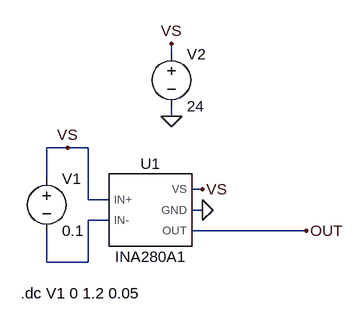
[diagram p0: schematic INA280A1_test.asc]
INA280A1_test.asc, the LTspice schematic file:
Version 4
SHEET 1 880 680
WIRE 0 -80 0 -96
WIRE 0 16 0 0
WIRE -160 64 -192 64
WIRE -128 64 -160 64
WIRE -192 112 -192 64
WIRE 48 128 32 128
WIRE -128 144 -128 64
WIRE -96 144 -128 144
WIRE 48 160 32 160
WIRE -96 176 -128 176
WIRE 208 192 32 192
WIRE -192 240 -192 192
WIRE -128 240 -128 176
WIRE -128 240 -192 240
FLAG 0 16 0
FLAG 0 -96 VS
FLAG 48 128 VS
FLAG 48 160 0
FLAG 208 192 OUT
FLAG -160 64 VS
SYMBOL INA280A1 -32 160 R0
SYMATTR InstName U1
SYMBOL voltage -192 96 R0
WINDOW 123 0 0 Left 0
WINDOW 39 0 0 Left 0
SYMATTR InstName V1
SYMATTR Value 0.1
SYMBOL voltage 0 -96 R0
WINDOW 123 0 0 Left 0
WINDOW 39 0 0 Left 0
SYMATTR InstName V2
SYMATTR Value 24
TEXT -232 288 Left 2 !.dc V1 0 1.2 0.05

The netlist it stands for:
* INA280A1_test.asc
XU1 VS N001 VS 0 OUT INA280A1  ; pins IN+ IN- VS GND OUT
V1 VS N001 0.1
V2 VS 0 24
.dc V1 0 1.2 0.05
.lib C:\Users\Tachi\Documents\Nerd Shit\rm_electrical-supercap\SPICE_sims\libraries\INA280A1.lib
.backanno
.end